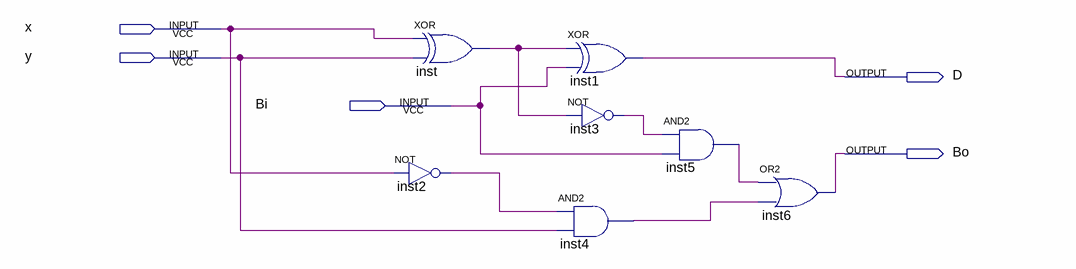
[diagram p0: schematic sheet]
// Quartus schematic FullSubtractor1.bdf as structural Verilog: 7 symbols, 5 pins
module FullSubtractor1 (
  input  x,
  input  y,
  input  Bi,
  output D,
  output Bo
);

  wire inst2_out, inst3_out, inst4_out, inst5_out, inst_out;

  xor inst (inst_out, x, y);
  not inst2 (inst2_out, x);
  xor inst1 (D, inst_out, Bi);
  not inst3 (inst3_out, inst_out);
  and inst4 (inst4_out, inst2_out, y);
  and inst5 (inst5_out, inst3_out, Bi);
  or inst6 (Bo, inst5_out, inst4_out);
endmodule
